# Altium schematic sheet Sheet2_StepUpDCDCConverter.SchDoc
size A
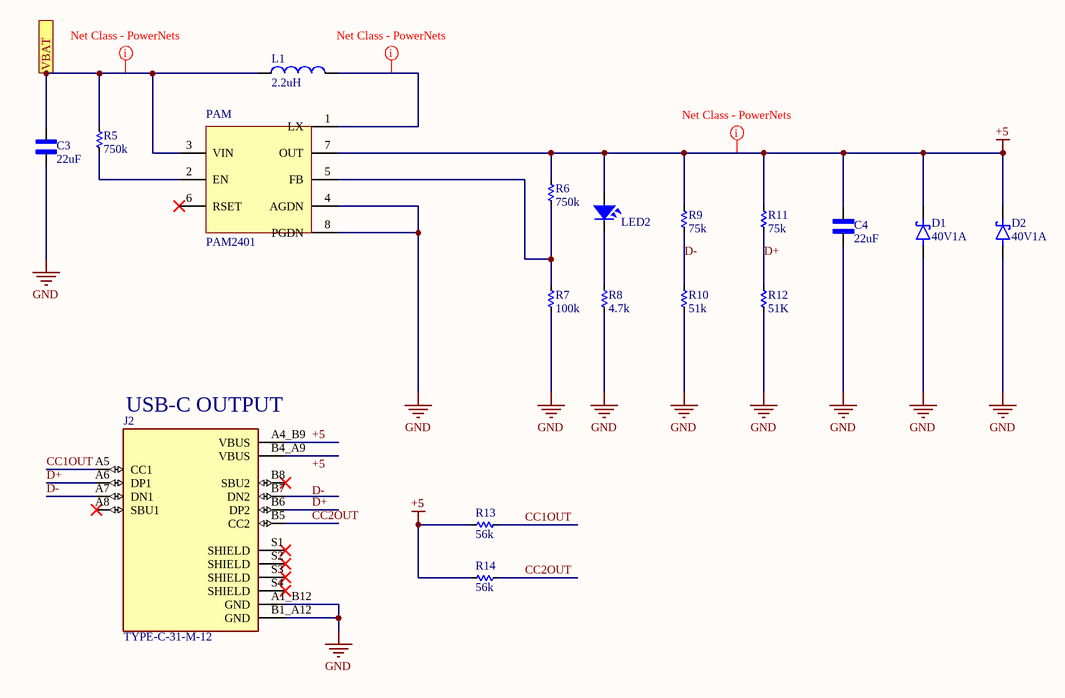
[diagram p0: Sheet2_StepUpDCDCConverter.SchDoc]

## Parts
C3  22uF  [CAPC2012X140N]
C4  22uF  [CAPC2012X140N]
D1  40V1A  [DIOM4326X240N]
D2  40V1A  [DIOM4326X240N]
J2  TYPE-C-31-M-12  [HRO_TYPE-C-31-M-12]
L1  2.2uH  [INDC2520X100N]
LED2  LED  [LED-0805-Red]  (value not drawn)
PAM  PAM2401  [TSOP65P490X110-8N]
R5  750k  [RES-SMD-0805]
R6  750k  [RES-SMD-0805]
R7  100k  [RES-SMD-0805]
R8  4.7k  [RES-SMD-0805]
R9  75k  [RES-SMD-0805]
R10  51k  [RES-SMD-0805]
R11  75k  [RES-SMD-0805]
R12  51K  [RES-SMD-0805]
R13  56k  [RES-SMD-0805]
R14  56k  [RES-SMD-0805]

## Ports
VBAT

## Nets
+5: C4.2 D1.C(K) D2.C(K) J2.A4_B9(VBUS) LED2.1 PAM.7(OUT) R6.1 R9.1 R11.1 R13.2 R14.2
GND: C3.1 C4.1 D1.A D2.A J2.A1_B12(GND) J2.B1_A12(GND) PAM.4(AGDN) PAM.8(PGDN) R7.2 R8.2 R10.2 R12.2
CC1OUT: J2.A5(CC1) R13.1
CC2OUT: J2.B5(CC2) R14.1
D+: J2.A6(DP1) J2.B6(DP2) R11.2 R12.1
D-: J2.A7(DN1) R9.2 R10.1
VBAT: C3.2 L1.1 PAM.3(VIN) R5.1 ; port VBAT
NetL1_2: L1.2 PAM.1(LX)
NetLED2_2: LED2.2 R8.1
NetPAM_2: PAM.2(EN) R5.2
NetPAM_5: PAM.5(FB) R6.2 R7.1

Not connected (* = marked no-connect by the designer): J2 A8(SBU1)* B4_A9(VBUS) B7(DN2) B8(SBU2)* S1(SHIELD)* S2(SHIELD)* S3(SHIELD)* S4(SHIELD)*; PAM 6(RSET)*

## Layout directives
net class PowerNets: NetL1_2, VBAT
mark named Net Class - PowerNets: +5

## Notes on the sheet
- (near J2) USB-C OUTPUT
- Labels drawn without touching a wire or pin: +5, D-

## Library data of the parts
C3 C4 = GRM21BR60J226ME39K: SMD capacitor X5R(EIA) with capacitance 22uF Tol.20%. Rated voltage 6.3Vdc 85C; MF: Murata Electronics; SnapEDA_Link: https://www.snapeda.com/parts/GRM21BR60J226ME39K/Murata+Electronics+North+America/view-part/?ref=snap; Package: 2012 Murata; Value: *; MP: GRM21BR60J226ME39K; Check_prices: https://www.snapeda.com/parts/GRM21BR60J226ME39K/Murata+Electronics+North+America/view-part/?ref=eda
D1 D2 = B140-13-F: Schottky Diode 1A 40V 0.5Vf SMA | Diodes Inc B140-13-F; MF: Diodes Inc.; SnapEDA_Link: https://www.snapeda.com/parts/B140-13-F/Diodes+Inc./view-part/?ref=snap; Package: DO-214 Diodes Inc.; Value: *; MP: B140-13-F; Check_prices: https://www.snapeda.com/parts/B140-13-F/Diodes+Inc./view-part/?ref=eda
J2 = TYPE-C-31-M-12: USB Connectors 24 Receptacle 1 8.94*7.3mm RoHS; MF: HRO Electronics Co., Ltd.; SnapEDA_Link: https://www.snapeda.com/parts/TYPE-C-31-M-12/HRO+Electronics+Co.%252C+Ltd./view-part/?ref=snap; Package: Package; Value: *; MP: TYPE-C-31-M-12; Check_prices: https://www.snapeda.com/parts/TYPE-C-31-M-12/HRO+Electronics+Co.%252C+Ltd./view-part/?ref=eda
L1 = LQM2HPN2R2MGSL: Inductor with Inductance: 2.2uH Tol. +/-20%, Package: 1008 (2520); MF: Murata; Price: None; Value: *; Check_prices: https://www.snapeda.com/parts/LQM2HPN2R2MGSL/Murata/view-part/1514108/?ref=eda; Package: 2520 Murata; SnapEDA_Link: https://www.snapeda.com/parts/LQM2HPN2R2MGSL/Murata/view-part/1514108/?ref=snap; Purchase-URL: https://pricing.snapeda.com/search/part/LQM2HPN2R2MGSL/?ref=eda; Availability: In Stock; MP: LQM2HPN2R2MGSL
LED2 = LED SMD: Value: LED 3 - 5 ly 2 Colour
R5-R14 = Res-SMD: Resistor; Manufacturer: Generic Components; Class: Passive; Published: 08/06/2000; Publisher: Altium Hobart Technology Centre